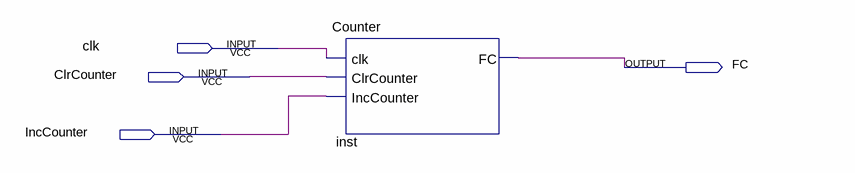
[diagram p0: schematic sheet]
// Quartus schematic practica5.bdf as structural Verilog: 1 symbols, 4 pins
module practica5 (
  input  clk,
  input  ClrCounter,
  input  IncCounter,
  output FC
);

  Counter inst (.clk(clk), .ClrCounter(ClrCounter), .IncCounter(IncCounter), .FC(FC));
endmodule
